# Altium schematic sheet ROS_Stm32_Control.SchDoc
size A4
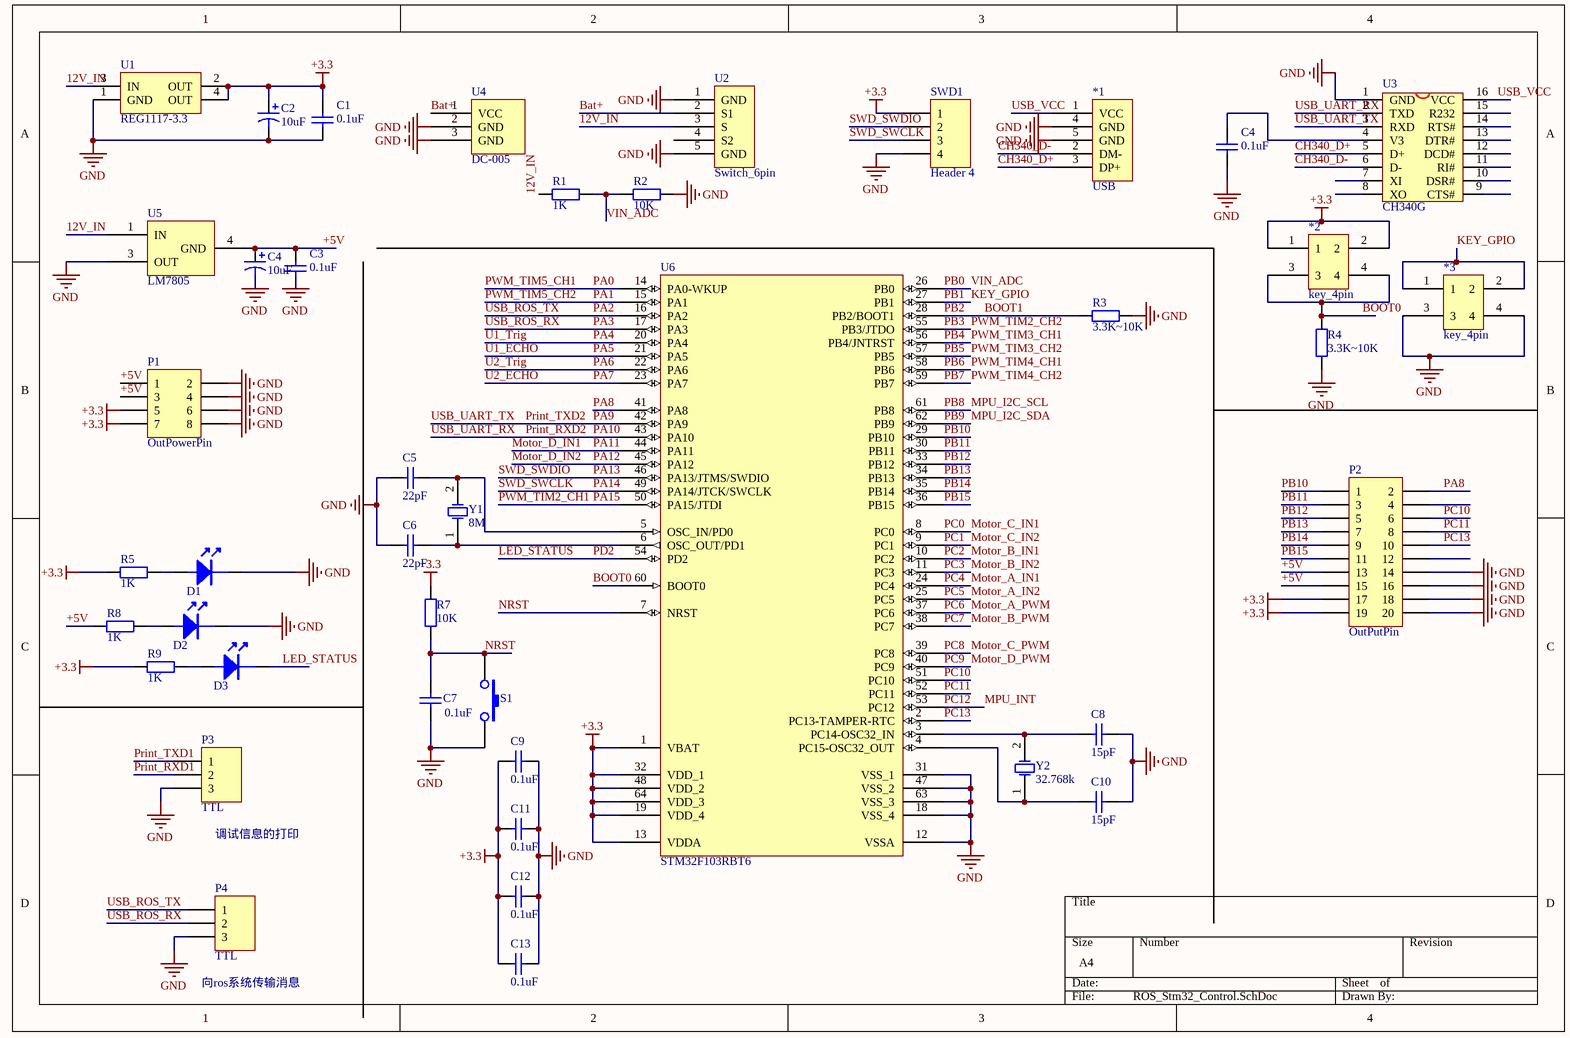
[diagram p0: ROS_Stm32_Control.SchDoc]

## Parts
(Parts that share a designator on the sheet are numbered #1, #2 ... from top to bottom, then left to right.)
*1  USB  [USB]
*2  key_4pin  [SW-SMD_4P-L5.1-W5.1-P3.70-LS6.4]
*3  key_4pin  [SW-SMD_4P-L5.1-W5.1-P3.70-LS6.4]
C1  0.1uF  [0603-res]
C2  10uF  [0603-res]
C3  0.1uF  [0603-res]
C4#1  0.1uF  [0603-res]
C4#2  10uF  [0603-res]
C5  22pF  [0603-res]
C6  22pF  [0603-res]
C7  0.1uF  [0603-res]
C8  15pF  [0603-res]
C9  0.1uF  [0603-res]
C10  15pF  [0603-res]
C11  0.1uF  [0603-res]
C12  0.1uF  [0603-res]
C13  0.1uF  [0603-res]
D1  LED  [0805]  (value not drawn)
D2  LED  [0805]  (value not drawn)
D3  LED  [0805]  (value not drawn)
P1  OutPowerPin  [HDR2X4]
P2  OutPutPin  [HDR2X10]
P3  TTL  [HDR1X3]
P4  TTL  [HDR1X3]
R1  1K  [0603-res]
R2  10K  [0603-res]
R3  3.3K~10K  [0603-res]
R4  3.3K~10K  [0603-res]
R5  1K  [0603-res]
R7  10K  [0603-res]
R8  1K  [0603-res]
R9  1K  [0603-res]
S1  KEY  [KEY_SOP]  (value not drawn)
SWD1  Header 4  [HDR1X4]
U1  REG1117-3.3  [ZZ311]
U2  Switch_6pin  [Switch_6pin]
U3  CH340G  [SOP16M]
U4  DC-005  [DC-005]
U5  LM7805  [TO-252-2_L6.5-W6.1-P4.58-LS10.0-TL]
U6  STM32F103RBT6  [LQFP64_N]
Y1  8M  [OSC2PR-1]
Y2  32.768k  [XTAL-B]

## Nets
+3.3: *2.1 *2.2 C1.2 C2.1 C9.1 C11.1 C12.1 C13.1 P1.5 P1.7 P2.17 P2.19 R5.1 R7.2 R9.1 SWD1.1 U1.2(OUT) U1.4(OUT) U6.1(VBAT) U6.13(VDDA) U6.19(VDD_4) U6.32(VDD_1) U6.48(VDD_2) U6.64(VDD_3)
GND: *1.4(GND) *1.5(GND) *3.3 *3.4 C1.1 C2.2 C3.1 C4#1.1 C4#2.2 C5.1 C6.1 C7.1 C8.2 C9.2 C10.2 C11.2 C12.2 C13.2 D1.2 D2.2 P1.2 P1.4 P1.6 P1.8 P2.14 P2.16 P2.18 P2.20 P3.3 P4.3 R2.2 R3.2 R4.1 S1.2 SWD1.4 U1.1(GND) U2.1(GND) U2.5(GND) U3.1(GND) U4.2(GND) U4.3(GND) U5.3(OUT) U6.12(VSSA) U6.18(VSS_4) U6.31(VSS_1) U6.47(VSS_2) U6.63(VSS_3)
12V_IN: R1.1 U1.3(IN) U2.3(S) U5.1(IN)
+5V: C3.2 C4#2.1 P1.1 P1.3 P2.13 P2.15 R8.1 U5.4(GND)
Bat+: U2.2(S1) U4.1(VCC)
BOOT0: *2.3 *2.4 R4.2 U6.60(BOOT0)
BOOT1: R3.1 U6.28(PB2/BOOT1)  [also labelled PB2]
CH340_D+: *1.3(DP+) U3.5(D+)
CH340_D-: *1.2(DM-) U3.6(D-)
KEY_GPIO: *3.1 *3.2 U6.27(PB1)  [also labelled PB1]
LED_STATUS: D3.2 U6.54(PD2)  [also labelled PD2]
Motor_A_IN1: U6.24(PC4)  [also labelled PC4]
Motor_A_IN2: U6.25(PC5)  [also labelled PC5]
Motor_A_PWM: U6.37(PC6)  [also labelled PC6]
Motor_B_IN1: U6.10(PC2)  [also labelled PC2]
Motor_B_IN2: U6.11(PC3)  [also labelled PC3]
Motor_B_PWM: U6.38(PC7)  [also labelled PC7]
Motor_C_IN1: U6.8(PC0)  [also labelled PC0]
Motor_C_IN2: U6.9(PC1)  [also labelled PC1]
Motor_C_PWM: U6.39(PC8)  [also labelled PC8]
Motor_D_IN1: U6.44(PA11)  [also labelled PA11]
Motor_D_IN2: U6.45(PA12)  [also labelled PA12]
Motor_D_PWM: U6.40(PC9)  [also labelled PC9]
MPU_I2C_SCL: U6.61(PB8)  [also labelled PB8]
MPU_I2C_SDA: U6.62(PB9)  [also labelled PB9]
MPU_INT: U6.53(PC12)  [also labelled PC12]
NRST: C7.2 R7.1 S1.1 U6.7(NRST)
PA0: U6.14(PA0-WKUP)  [also labelled PWM_TIM5_CH1]
PA1: U6.15(PA1)  [also labelled PWM_TIM5_CH2]
PA2: P4.1 U6.16(PA2)  [also labelled USB_ROS_TX]
PA3: P4.2 U6.17(PA3)  [also labelled USB_ROS_RX]
PA4: U6.20(PA4)  [also labelled U1_Trig]
PA5: U6.21(PA5)  [also labelled U1_ECHO]
PA6: U6.22(PA6)  [also labelled U2_Trig]
PA7: U6.23(PA7)  [also labelled U2_ECHO]
PA8: P2.2 U6.41(PA8)
PA9: U3.3(RXD) U6.42(PA9)  [also labelled Print_TXD2, USB_UART_TX]
PA10: U3.2(TXD) U6.43(PA10)  [also labelled Print_RXD2, USB_UART_RX]
PA13: SWD1.2 U6.46(PA13/JTMS/SWDIO)  [also labelled SWD_SWDIO]
PA14: SWD1.3 U6.49(PA14/JTCK/SWCLK)  [also labelled SWD_SWCLK]
PA15: U6.50(PA15/JTDI)  [also labelled PWM_TIM2_CH1]
PB0: R1.2 R2.1 U6.26(PB0)  [also labelled VIN_ADC]
PB3: U6.55(PB3/JTDO)  [also labelled PWM_TIM2_CH2]
PB4: U6.56(PB4/JNTRST)  [also labelled PWM_TIM3_CH1]
PB5: U6.57(PB5)  [also labelled PWM_TIM3_CH2]
PB6: U6.58(PB6)  [also labelled PWM_TIM4_CH1]
PB7: U6.59(PB7)  [also labelled PWM_TIM4_CH2]
PB10: P2.1 U6.29(PB10)
PB11: P2.3 U6.30(PB11)
PB12: P2.5 U6.33(PB12)
PB13: P2.7 U6.34(PB13)
PB14: P2.9 U6.35(PB14)
PB15: P2.11 U6.36(PB15)
PC10: P2.6 U6.51(PC10)
PC11: P2.8 U6.52(PC11)
PC13: P2.10 U6.2(PC13-TAMPER-RTC)
Print_RXD1: P3.2
Print_TXD1: P3.1
USB_VCC: *1.1(VCC) U3.16(VCC)
NetC4#1_2: C4#1.2 U3.4(V3)
NetC5_2: C5.2 U6.5(OSC_IN/PD0) Y1.2(OSC2)
NetC6_2: C6.2 U6.6(OSC_OUT/PD1) Y1.1(OSC1)
NetC8_1: C8.1 U6.3(PC14-OSC32_IN) Y2.2(OSC2)
NetC10_1: C10.1 U6.4(PC15-OSC32_OUT) Y2.1(OSC1)
NetD1_1: D1.1 R5.2
NetD2_1: D2.1 R8.2
NetD3_1: D3.1 R9.2

Not connected (* = marked no-connect by the designer): P2 4 12; U2 4(S2); U3 7(XI) 8(XO) 9(CTS#) 10(DSR#) 11(RI#) 12(DCD#) 13(DTR#) 14(RTS#) 15(R232)

## Notes on the sheet
- 调试信息的打印
- (near P4) 向ros系统传输消息

## Library data of the parts
C1 C3 C4#1 C5-C13 = Cap: Capacitor; Published: 8-Jun-2000; LatestRevisionDate: 17-Jul-2002; LatestRevisionNote: Re-released for DXP Platform.; PackageReference: RAD-0.3; Publisher: Altium Limited
  C1 C3 C4#1 C7 C9 C11-C13: Value: 0.1uF
  C5 C6: Value: 22pF
  C8 C10: Value: 15pF
C2 C4#2 = Cap Pol1: Polarized Capacitor (Radial); Published: 8-Jun-2000; LatestRevisionDate: 17-Jul-2002; LatestRevisionNote: Re-released for DXP Platform.; PackageReference: RB7.6-15; Publisher: Altium Limited; Value: 10uF
P1 = Header 4X2: Header, 4-Pin, Dual row; LatestRevisionDate: 17-Jul-2002; LatestRevisionNote: Re-released for DXP Platform.; Publisher: Altium Limited
P2 = Header 10X2: Header, 10-Pin, Dual row; LatestRevisionDate: 17-Jul-2002; LatestRevisionNote: Re-released for DXP Platform.; Publisher: Altium Limited
P3 P4 = Header 3: Header, 3-Pin; LatestRevisionDate: 17-Jul-2002; LatestRevisionNote: Re-released for DXP Platform.; Publisher: Altium Limited
R1 R5 R7-R9 = Res2: Resistor; Published: 8-Jun-2000; LatestRevisionDate: 17-Jul-2002; LatestRevisionNote: Re-released for DXP Platform.; PackageReference: AXIAL-0.4; Publisher: Altium Limited
  R1 R5 R8 R9: Value: 1K
  R7: Value: 10K
R2-R4 = Res2: Resistor; Value: 1K; Published: 8-Jun-2000; LatestRevisionDate: 17-Jul-2002; LatestRevisionNote: Re-released for DXP Platform.; PackageReference: AXIAL-0.4; Publisher: Altium Limited
SWD1 = Header 4: Header, 4-Pin; LatestRevisionDate: 17-Jul-2002; LatestRevisionNote: Re-released for DXP Platform.; Publisher: Altium Limited
U1 = REG1117-3.3: 800mA and 1A Low Dropout Positive Regulator 2.85V, 3.3V, 5V, and Adjustable; Published: 8-Jun-2000; LatestRevisionDate: 17-Jul-2002; LatestRevisionNote: Re-released for DXP Platform.; DatasheetVersion: Sep-1997; PackageVersion: revC; PackageReference: ZZ311; Publisher: Altium Limited; PackageDescription: SOT-223/SC-73; 4 Leads; Body 6.7 x 7.3 mm, inc. leads (LxW max); ComponentLink1Description: Manufacturer Link; ComponentLink1URL: http://www.ti.com/; ComponentLink2Description: Datasheet; ComponentLink2URL: http://www-s.ti.com/sc/ds/REG1117.pdf
U3 = CH340G: USB2UART
U6 = STM32F103RBT6: STM32 ARM-based 32-bit MCU with 128 Kbytes Flash, 64-pin LQFP, Industrial Temperature; Published: 30-May-2008; DatasheetVersion: rev6, Mar-2008; PackageVersion: Mar-2008; PackageReference: LQFP64; Publisher: Altium Limited; PackageDescription: 64-Pin Low-Profile Quad Flat Pack, 10 x 10 mm Body, 0.5 mm Pitch (LQFP64); ComponentLink1Description: Manufacturer Link; ComponentLink1URL: www.st.com/stm32; ComponentLink2Description: Datasheet; ComponentLink2URL: http://www.st.com/stonline/products/literature/ds/13587.pdf
Y1 Y2 = XTAL: Crystal Oscillator; Published: 8-Jun-2000; LatestRevisionDate: 17-Jul-2002; LatestRevisionNote: Re-released for DXP Platform.; PackageReference: R38; Publisher: Altium Limited